# EAGLE design pacman (EAGLE 7.1.0)
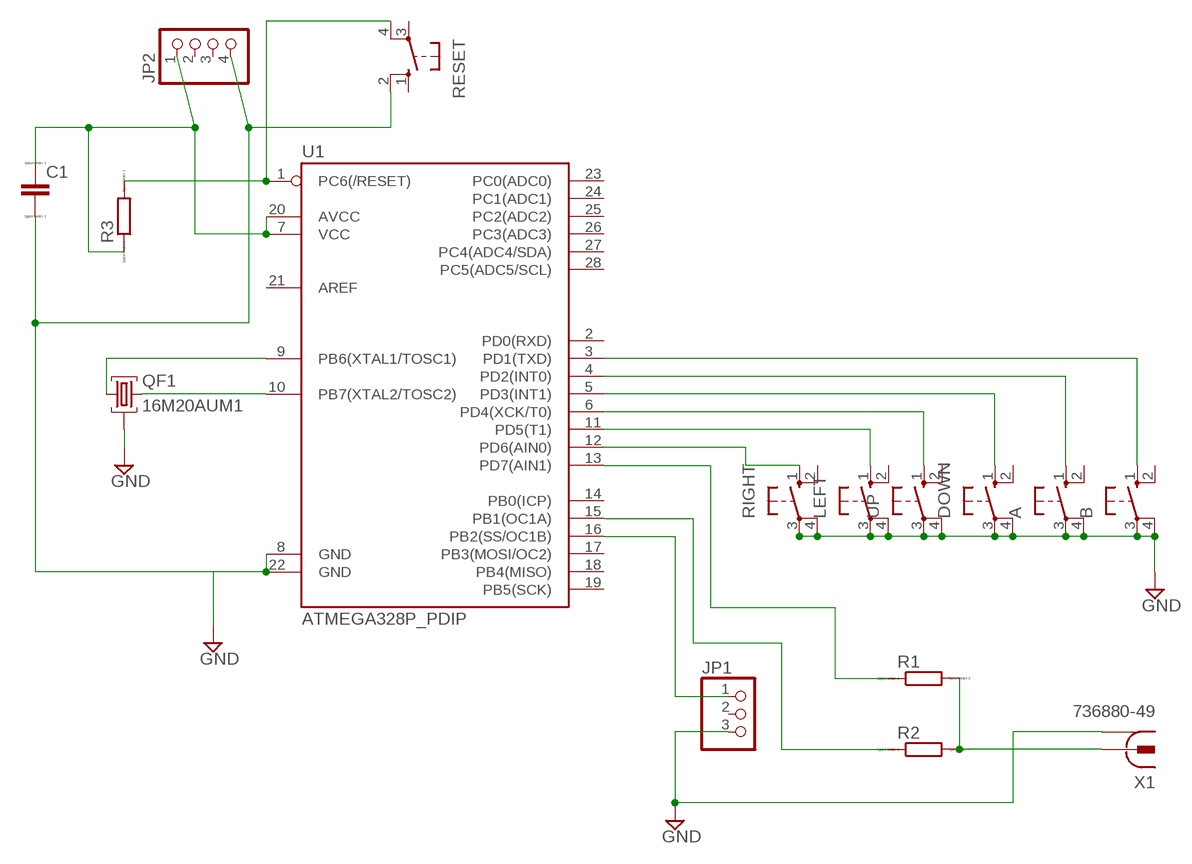
[diagram p0: schematic, sheet 1]

## Parts
A  10-XX  [B3F-10XX]
B  10-XX  [B3F-10XX]
C1  CC3225  [C3225]
DOWN  10-XX  [B3F-10XX]
JP1  PINHD-1X3  [1X03]
JP2  PINHD-1X4  [1X04]
LEFT  10-XX  [B3F-10XX]
QF1  16M20AUM1  [UM1]
R1  RR0603  [R0603]
R2  RR0603  [R0603]
R3  RR0603  [R0603]
RESET  10-XX  [B3F-10XX]
RIGHT  10-XX  [B3F-10XX]
U1  ATMEGA328P_PDIP  [DIL28-3]
UP  10-XX  [B3F-10XX]
X1  736880-49  [736880-49]

## Nets
GND: A.3(P) A.4(P1) B.3(P) B.4(P1) C1.2 DOWN.3(P) DOWN.4(P1) JP1.3 JP2.4 LEFT.3(P) LEFT.4(P1) QF1.2 RESET.2(S1) RIGHT.3(P) RIGHT.4(P1) U1.8(GND) U1.22(GND) UP.3(P) UP.4(P1) X1.1 X1.1@1 X1.1@2
N$1: RIGHT.1(S) U1.12(PD6(AIN0))
N$2: LEFT.1(S) U1.11(PD5(T1))
N$3: U1.6(PD4(XCK/T0)) UP.1(S)
N$4: DOWN.1(S) U1.5(PD3(INT1))
N$5: A.1(S) U1.4(PD2(INT0))
N$6: B.1(S) U1.3(PD1(TXD))
N$7: JP1.1 U1.16(PB2(SS/OC1B))
N$8: R2.1 U1.15(PB1(OC1A))
N$9: R1.1 U1.13(PD7(AIN1))
N$10: R1.2 R2.2 X1.2
N$11: C1.1 JP2.1 R3.1 U1.7(VCC) U1.20(AVCC)
N$13: QF1.3 U1.10(PB7(XTAL2/TOSC2))
N$14: QF1.1 U1.9(PB6(XTAL1/TOSC1))
N$16: R3.2 RESET.4(P1) U1.1(PC6(/RESET))
Unconnected: A.2(S1) B.2(S1) DOWN.2(S1) JP1.2 JP2.2 JP2.3 LEFT.2(S1) RESET.1(S) RESET.3(P) RIGHT.2(S1) U1.2(PD0(RXD)) U1.14(PB0(ICP)) U1.17(PB3(MOSI/OC2)) U1.18(PB4(MISO)) U1.19(PB5(SCK)) U1.21(AREF) U1.23(PC0(ADC0)) U1.24(PC1(ADC1)) U1.25(PC2(ADC2)) U1.26(PC3(ADC3)) U1.27(PC4(ADC4/SDA)) U1.28(PC5(ADC5/SCL)) UP.2(S1)

## Library data of the parts
A B DOWN LEFT RESET RIGHT UP = switch-omron:10-XX: OMRON SWITCH; MPN: B3F-1000; OC_FARNELL: 176432; OC_NEWARK: 36M3542
C1 = eagle-ltspice:C: CAPACITOR, European symbol; SPICEMODEL: NONE; SPICEPREFIX: C
JP1 = pinhead:PINHD-1X3: PIN HEADER
JP2 = pinhead:PINHD-1X4: PIN HEADER
QF1 = crystal:16M20AUM1: Monolithic Crystal Filters Source: www.vanlong.com; OC_FARNELL: unknown; OC_NEWARK: unknown
R1-R3 = eagle-ltspice:R: RESISTOR, European symbol; SPICEMODEL: NONE; SPICEPREFIX: R
U1 = SparkFun-DigitalIC:ATMEGA328P_PDIP: uC used in the Arduino 32kb flash, 1k EEPROM, 2k SRAM This is the through-hole version of this chip.
X1 = con-conrad:736880-49: Cinch Connector ( RCA Jack ) Cinch-Einbaukupplung 90º 72345 Vernickelt BKL Electronic Source: Conrad <http://www.conrad.de/ce/de/product/736880>

## Board
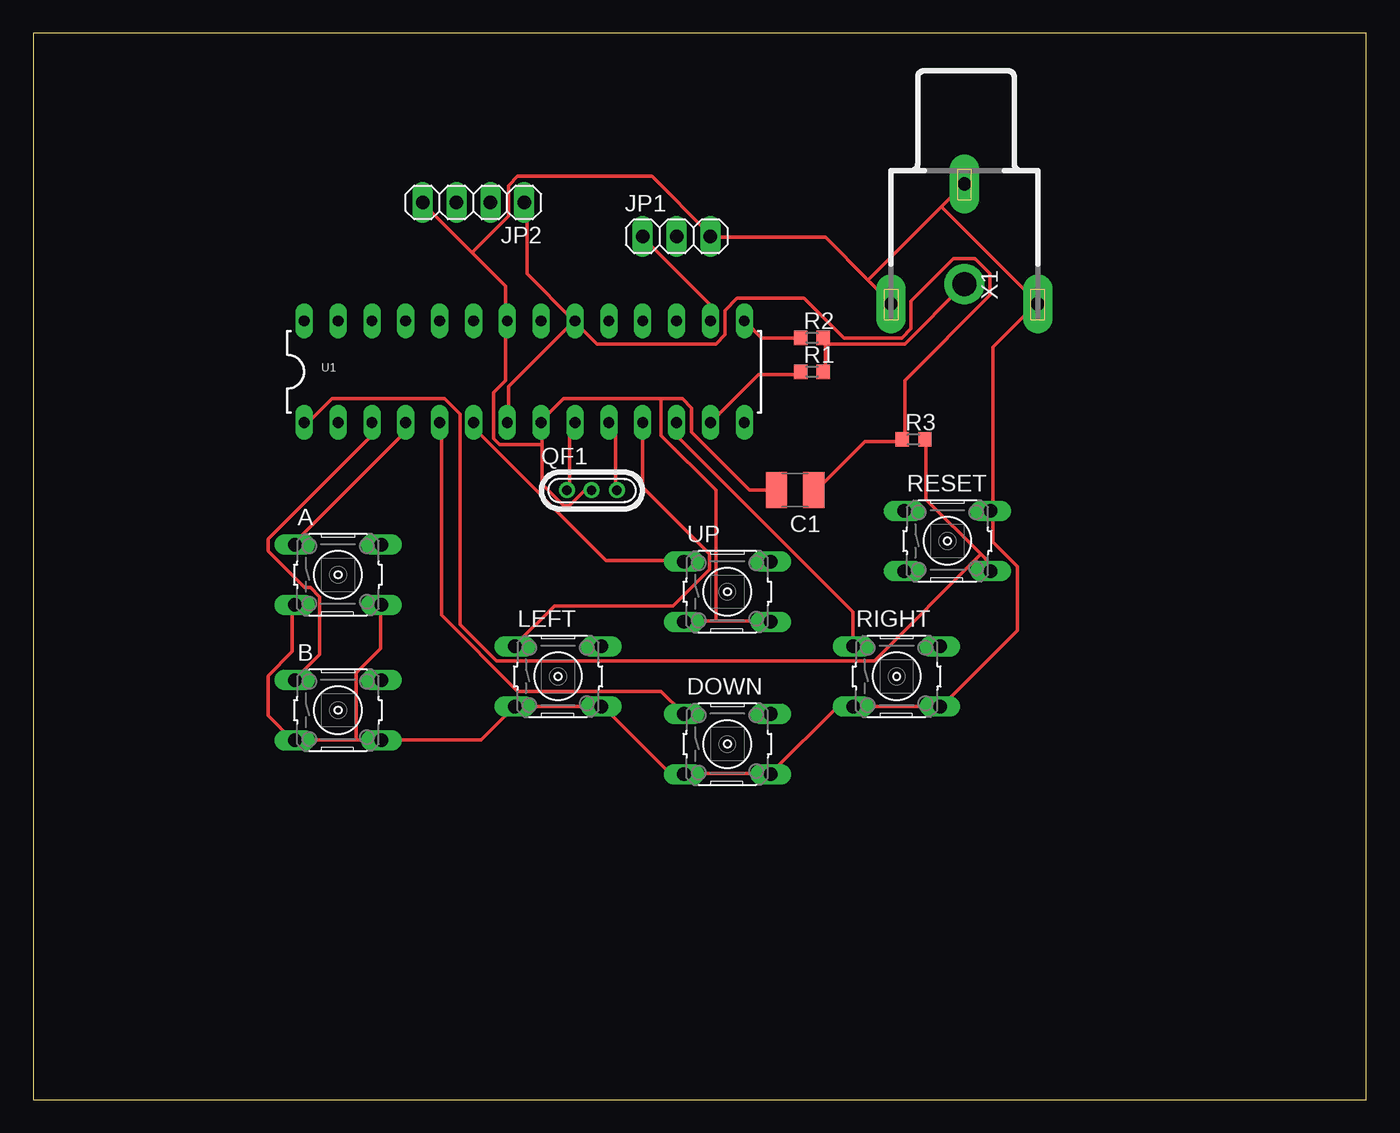
[diagram p1: board, top side]

Size 100 x 80 mm. Coordinates in mm from the lower left corner, seen from the top.
Outline: 0,0 100,0 100,80 0,80 0,0
Copper layers (1*16): Top 0.035mm / dielectric 1.5mm / Bottom 0.035mm
Design rules "default": minimum track width 10mil, minimum drill 24mil, track to track 8mil, track to pad 8mil, pad to pad 8mil, via to via 8mil, smd to smd 8mil, copper to edge 40mil, drill to drill 8mil, minimum pad ring 10mil, minimum via ring 8mil, stop-mask expansion 4mil, vias tented up to drill 0mil, thermal gap 10mil

### Footprints (pad centres in the part's own frame; a part is rotated, then mirrored left to right if it is on the bottom)
B3F-10XX = drill 1.016 long: 1 -3.251,2.261; 2 3.251,2.261; 3 -3.251,-2.261; 4 3.251,-2.261
C3225 = smd 1.6 x 2.7: 1 -1.4,0; 2 1.4,0
1X03 = drill 1.016 long: 1 -2.54,0; 2 0,0; 3 2.54,0
1X04 = drill 1.016 long: 1 -3.81,0; 2 -1.27,0; 3 1.27,0; 4 3.81,0
UM1 = drill 0.7 pad 1.2: 1 -1.875,0; 2 -0.027,0; 3 1.875,0
R0603 = smd 1 x 1.1: 1 -0.85,0; 2 0.85,0
DIL28-3 = drill 0.813 long: 1 -16.51,-3.81; 2 -13.97,-3.81; 3 -11.43,-3.81; 4 -8.89,-3.81; 5 -6.35,-3.81; 6 -3.81,-3.81; 7 -1.27,-3.81; 8 1.27,-3.81; 9 3.81,-3.81; 10 6.35,-3.81; 11 8.89,-3.81; 12 11.43,-3.81; 13 13.97,-3.81; 14 16.51,-3.81; 15 16.51,3.81; 16 13.97,3.81; 17 11.43,3.81; 18 8.89,3.81; 19 6.35,3.81; 20 3.81,3.81; 21 1.27,3.81; 22 -1.27,3.81; 23 -3.81,3.81; 24 -6.35,3.81; 25 -8.89,3.81; 26 -11.43,3.81; 27 -13.97,3.81; 28 -16.51,3.81
736880-49 = drill 1 pad 2.2 long: 1 -3.92,0; 1@1 5.08,-5.5; 1@2 5.08,5.5 | drill 1.8 pad 3: 2 3.58,0

### Placement (x,y rotation side)
A  22.86,39.37 0 top
B  22.86,29.21 0 top
C1  57.15,45.72 180 top
DOWN  52.07,26.67 0 top
JP1  48.26,64.77 0 top
JP2  33.02,67.31 180 top
LEFT  39.37,31.75 0 top
QF1  41.91,45.72 0 top
R1  58.42,54.61 0 top
R2  58.42,57.15 0 top
R3  66.04,49.53 0 top
RESET  68.58,41.91 0 top
RIGHT  64.77,31.75 0 top
U1  36.83,54.61 0 top
UP  52.07,38.1 0 top
X1  69.85,64.77 270 top

### Tracks (layer width: path | path; a pad name or v marks a point on that pad's centre or on a via)
GND
  Top 0.254: 32.92,63.55 29.26,67.21 JP2.4 | 32.92,63.55 35.43,61.04 35.43,58.52 U1.22 35.43,58.29 35.43,53.95 34.52,53.03 34.52,49.61 34.98,49.15 38.18,49.15 | 51.21,35.89 55.32,35.89 UP.4 | 51.21,35.89 48.92,35.89 UP.3 | QF1.2 41.38,45.72 40.23,44.58 39.78,44.58 38.18,46.18 38.18,49.15 | 38.18,49.15 38.18,50.75 U1.8 38.18,50.98 39.78,52.58 47.09,52.58 | C1.2 53.72,45.72 49.38,50.06 49.38,51.89 48.69,52.58 47.09,52.58 | 51.21,35.89 51.21,45.72 47.09,49.84 47.09,52.58 | 62.64,61.49 64.24,59.89 X1.1@1 | 62.64,61.49 59.44,64.69 50.98,64.69 JP1.3 50.75,64.92 46.41,69.27 36.35,69.27 35.66,68.58 35.66,66.29 32.92,63.55 | 62.64,61.49 68.12,66.98 | 68.12,66.98 69.72,68.58 X1.1 | 68.12,66.98 75.21,59.89 X1.1@2 75.21,59.66 72.01,56.46 72.01,44.35 RESET.2 72.01,44.12 72.01,41.83 73.84,40.01 73.84,35.2 68.12,29.49 RIGHT.4 RIGHT.3 60.35,29.49 55.32,24.46 | 24.23,26.98 26.06,26.98 B.4 26.29,26.98 33.6,26.98 LEFT.3 LEFT.4 42.75,29.49 47.78,24.46 48.69,24.46 DOWN.3 48.92,24.46 55.32,24.46 | 24.23,26.98 19.66,26.98 B.3 19.43,26.98 17.6,28.8 17.6,31.77 19.43,33.6 19.43,37.03 A.3 | 24.23,26.98 24.23,32 26.06,33.83 26.06,37.03 A.4 | 55.32,24.46 DOWN.4
N$1
  Top 0.254: U1.12 48.46,50.75 48.46,49.61 61.49,36.58 61.49,34.06 RIGHT.1
N$2
  Top 0.254: U1.11 45.72,45.95 50.75,40.92 50.75,39.78 48.01,37.03 39.09,37.03 36.12,34.06 LEFT.1
N$3
  Top 0.254: U1.6 33.15,50.75 33.15,50.29 42.98,40.46 48.69,40.46 UP.1
N$4
  Top 0.254: U1.5 30.63,50.75 30.63,36.35 36.35,30.63 47.09,30.63 48.69,29.03 DOWN.1
N$5
  Top 0.254: U1.4 27.89,50.75 27.89,50.06 19.66,41.83 A.1
N$6
  Top 0.254: U1.3 25.38,50.75 25.38,49.84 17.6,42.06 17.6,41.15 20.34,38.41 20.8,38.41 21.49,37.72 21.49,33.38 19.66,31.55 B.1
N$7
  Top 0.254: U1.16 50.75,58.52 50.75,59.66 45.72,64.69 JP1.1
N$8
  Top 0.254: R2.1 54.63,57.15 53.49,58.29 U1.15
N$9
  Top 0.254: U1.13 54.41,54.41 57.38,54.41 R1.1
N$10
  Top 0.254: 59.44,56.69 59.44,57.15 R2.2 59.44,56.69 | 59.44,56.69 59.44,54.63 R1.2 | 59.44,56.69 65.38,56.69 69.72,61.04 X1.2
N$11
  Top 0.254: C1.1 58.75,45.72 62.41,49.38 65.15,49.38 R3.1 65.38,49.61 65.38,53.95 71.78,60.35 71.78,61.95 70.64,63.09 69.04,63.09 65.84,59.89 65.84,57.84 65.15,57.15 60.81,57.15 57.84,60.12 52.81,60.12 51.89,59.21 51.89,57.38 51.21,56.69 42.29,56.69 40.69,58.29 U1.20 | U1.7 35.66,50.98 35.66,53.49 40.46,58.29 U1.20 | JP2.1 37.03,67.21 37.03,61.95 40.46,58.52 U1.20
N$13
  Top 0.254: QF1.3 43.66,45.72 43.66,50.29 43.2,50.75 U1.10
N$14
  Top 0.254: QF1.1 40.23,45.72 40.23,50.52 40.46,50.75 U1.9
N$16
  Top 0.254: 71.09,40.92 71.78,40.23 71.78,39.78 RESET.4 | 71.09,40.92 66.98,45.03 66.98,49.38 R3.2 | 71.09,40.92 63.09,32.92 34.75,32.92 32,35.66 32,51.44 30.86,52.58 22.4,52.58 20.8,50.98 20.34,50.98 U1.1